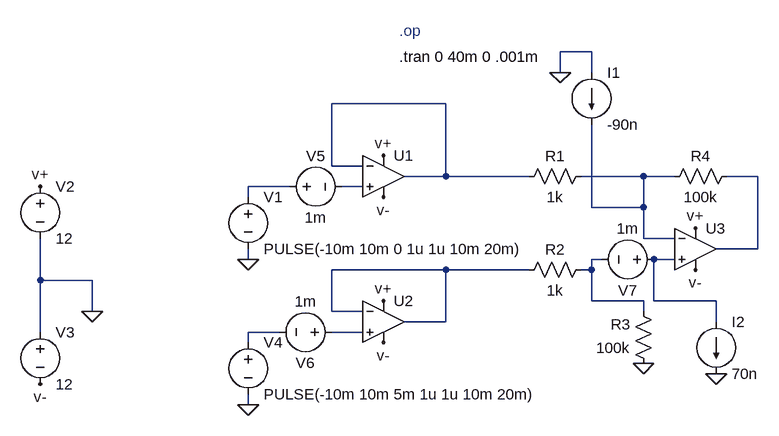
[diagram p0: schematic amp inst.asc]
amp inst.asc, the LTspice schematic file:
Version 4
SHEET 1 1748 680
WIRE 1040 -240 992 -240
WIRE 992 -208 992 -240
WIRE 1040 -208 1040 -240
WIRE 816 -160 640 -160
WIRE 640 -64 640 -160
WIRE 688 -64 640 -64
WIRE 816 -48 816 -160
WIRE 816 -48 752 -48
WIRE 944 -48 816 -48
WIRE 1120 -48 1024 -48
WIRE 1168 -48 1120 -48
WIRE 1296 -48 1248 -48
WIRE 576 -32 512 -32
WIRE 688 -32 656 -32
WIRE 512 -16 512 -32
WIRE 1040 0 1040 -128
WIRE 1120 0 1120 -48
WIRE 1120 0 1040 0
WIRE 1120 48 1120 0
WIRE 1168 48 1120 48
WIRE 1296 64 1296 -48
WIRE 1296 64 1232 64
WIRE 512 80 512 64
WIRE 1056 80 1040 80
WIRE 1168 80 1136 80
WIRE 816 96 640 96
WIRE 944 96 816 96
WIRE 1040 96 1040 80
WIRE 1040 96 1024 96
WIRE 192 112 192 48
WIRE 272 112 192 112
WIRE 1040 144 1040 96
WIRE 1120 144 1040 144
WIRE 1136 144 1136 80
WIRE 1232 144 1136 144
WIRE 272 160 272 112
WIRE 640 160 640 96
WIRE 688 160 640 160
WIRE 1120 160 1120 144
WIRE 816 176 816 96
WIRE 816 176 752 176
WIRE 1232 176 1232 144
WIRE 192 192 192 112
WIRE 560 192 512 192
WIRE 688 192 640 192
WIRE 512 208 512 192
WIRE 512 304 512 288
FLAG 272 160 0
FLAG 192 -32 v+
FLAG 720 -80 v+
FLAG 720 144 v+
FLAG 192 272 v-
FLAG 720 208 v-
FLAG 720 -16 v-
FLAG 1200 32 v+
FLAG 1200 96 v-
FLAG 512 80 0
FLAG 512 304 0
FLAG 1120 240 0
FLAG 992 -208 0
FLAG 1232 256 0
DATAFLAG 1296 16 ""
SYMBOL Opamps\\UniversalOpamp2 720 -48 R0
SYMATTR InstName U1
SYMBOL Opamps\\UniversalOpamp2 720 176 R0
SYMATTR InstName U2
SYMBOL voltage 192 -48 R0
WINDOW 123 0 0 Left 2
WINDOW 39 0 0 Left 2
SYMATTR InstName V2
SYMATTR Value 12
SYMBOL voltage 192 176 R0
WINDOW 123 0 0 Left 2
WINDOW 39 0 0 Left 2
SYMATTR InstName V3
SYMATTR Value 12
SYMBOL Opamps\\UniversalOpamp2 1200 64 R0
SYMATTR InstName U3
SYMBOL voltage 512 -32 R0
WINDOW 123 0 0 Left 0
WINDOW 39 0 0 Left 0
SYMATTR InstName V1
SYMATTR Value PULSE(-10m 10m 0 1u 1u 10m 20m)
SYMBOL voltage 512 192 R0
WINDOW 123 0 0 Left 0
WINDOW 39 0 0 Left 0
SYMATTR InstName V4
SYMATTR Value PULSE(-10m 10m 5m 1u 1u 10m 20m)
SYMBOL res 1040 -64 R90
WINDOW 0 0 56 VBottom 2
WINDOW 3 32 56 VTop 2
SYMATTR InstName R1
SYMATTR Value 1k
SYMBOL res 1040 80 R90
WINDOW 0 0 56 VBottom 2
WINDOW 3 32 56 VTop 2
SYMATTR InstName R2
SYMATTR Value 1k
SYMBOL res 1136 256 R180
WINDOW 0 36 76 Left 2
WINDOW 3 36 40 Left 2
SYMATTR InstName R3
SYMATTR Value 100k
SYMBOL res 1152 -32 R270
WINDOW 0 32 56 VTop 2
WINDOW 3 0 56 VBottom 2
SYMATTR InstName R4
SYMATTR Value 100k
SYMBOL voltage 560 -32 R270
WINDOW 0 32 56 VTop 2
WINDOW 3 -32 56 VBottom 2
WINDOW 123 0 0 Left 0
WINDOW 39 0 0 Left 0
SYMATTR InstName V5
SYMATTR Value 1m
SYMBOL voltage 656 192 R90
WINDOW 0 32 56 VTop 2
WINDOW 3 -32 56 VBottom 2
WINDOW 123 0 0 Left 0
WINDOW 39 0 0 Left 0
SYMATTR InstName V6
SYMATTR Value 1m
SYMBOL voltage 1152 80 R90
WINDOW 0 32 56 VTop 2
WINDOW 3 -32 56 VBottom 2
WINDOW 123 0 0 Left 0
WINDOW 39 0 0 Left 0
SYMATTR InstName V7
SYMATTR Value 1m
SYMBOL current 1040 -208 R0
WINDOW 123 0 0 Left 0
WINDOW 39 0 0 Left 0
SYMATTR InstName I1
SYMATTR Value -90n
SYMBOL current 1232 176 R0
WINDOW 123 0 0 Left 0
WINDOW 39 0 0 Left 0
SYMATTR InstName I2
SYMATTR Value 70n
TEXT 744 -232 Left 2 !.tran 0 40m 0 .001m
TEXT 744 -272 Left 2 ;.op

The netlist it stands for:
* amp inst.asc
XU1 N005 N001 v+ v- N001 level.2 Avol=1Meg GBW=10Meg Slew=10Meg ilimit=25m rail=0 Vos=0 phimargin=45 en=0 enk=0 in=0 ink=0 Rin=500Meg  ; pins IN+ IN- V+ V- OUT
XU2 N010 N008 v+ v- N008 level.2 Avol=1Meg GBW=10Meg Slew=10Meg ilimit=25m rail=0 Vos=0 phimargin=45 en=0 enk=0 in=0 ink=0 Rin=500Meg  ; pins IN+ IN- V+ V- OUT
V2 v+ 0 12
V3 0 v- 12
XU3 N007 N002 v+ v- N003 level.2 Avol=1Meg GBW=10Meg Slew=10Meg ilimit=25m rail=0 Vos=0 phimargin=45 en=0 enk=0 in=0 ink=0 Rin=500Meg  ; pins IN+ IN- V+ V- OUT
V1 N004 0 PULSE(-10m 10m 0 1u 1u 10m 20m)
V4 N009 0 PULSE(-10m 10m 5m 1u 1u 10m 20m)
R1 N002 N001 1k
R2 N006 N008 1k
R3 0 N006 100k
R4 N002 N003 100k
V5 N004 N005 1m
V6 N010 N009 1m
V7 N007 N006 1m
I1 0 N002 -90n
I2 N007 0 70n
.tran 0 40m 0 .001m
* .op
.lib UniversalOpamps2.sub
.backanno
.end